# Altium project cs301_YourGroupNumber.PrjPCB
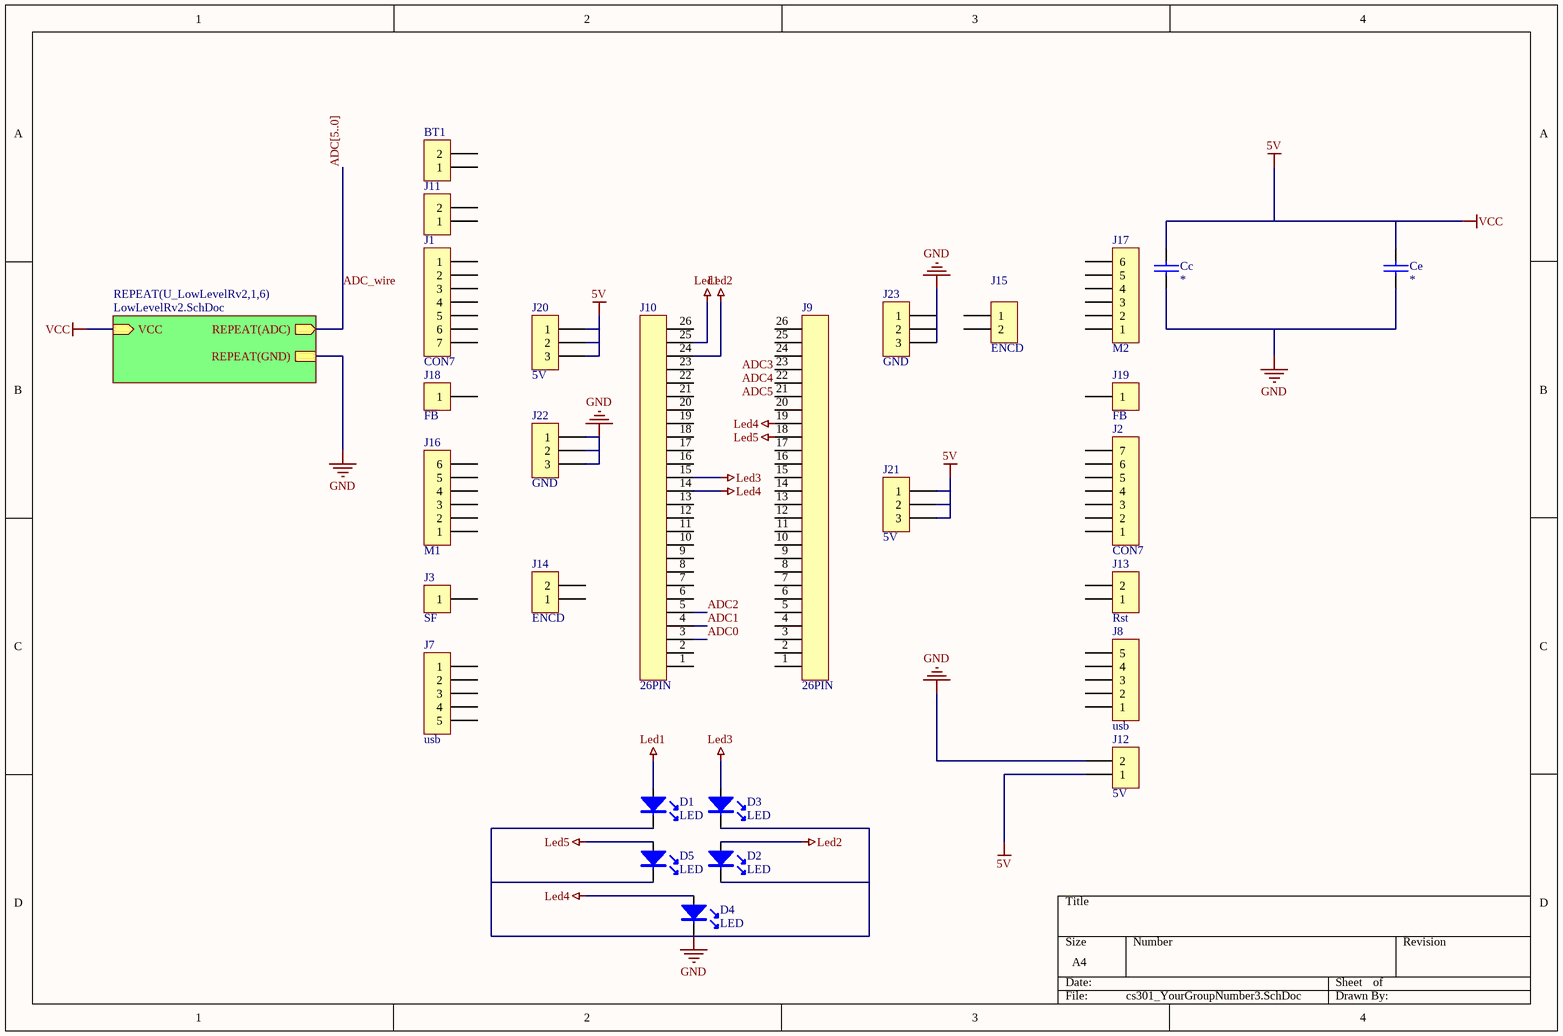
[diagram p0: cs301_YourGroupNumber3.SchDoc]
2 sheets, 118 parts. Net scope: hierarchical (ports join the sheet entries above them; power ports are global).
Board file: cs301_newrv2.PcbDoc
Sheets:
  cs301_YourGroupNumber3.SchDoc
    U_LowLevelRv21 = LowLevelRv2.SchDoc
    U_LowLevelRv22 = LowLevelRv2.SchDoc
    U_LowLevelRv23 = LowLevelRv2.SchDoc
    U_LowLevelRv24 = LowLevelRv2.SchDoc
    U_LowLevelRv25 = LowLevelRv2.SchDoc
    U_LowLevelRv26 = LowLevelRv2.SchDoc

## Sheet cs301_YourGroupNumber3.SchDoc
size A4

### Parts
BT1  Battery  [sip2]  (value not drawn)
Cc  *  [FILM CAP-0.2]
Ce  *  [FILM CAP-0.2]
D1  LED  [LED0.1/5MM]
D2  LED  [LED0.1/5MM]
D3  LED  [LED0.1/5MM]
D4  LED  [LED0.1/5MM]
D5  LED  [LED0.1/5MM]
J1  CON7  [SIP7]
J2  CON7  [SIP7]
J3  SF  [SIP1/0.6]
J7  usb  [SIP5]
J8  usb  [SIP5]
J9  26PIN  [SIP26]
J10  26PIN  [SIP26]
J11  Battery  [sip2]  (value not drawn)
J12  5V  [sip2]
J13  Rst  [sip2]
J14  ENCD  [sip2]
J15  ENCD  [sip2]
J16  M1  [sip6]
J17  M2  [sip6]
J18  FB  [SIP1/0.6]
J19  FB  [SIP1/0.6]
J20  5V  [sip3]
J21  5V  [sip3]
J22  GND  [sip3]
J23  GND  [sip3]

### Sub-sheets
REPEAT(U_LowLevelRv2,1,6) = LowLevelRv2.SchDoc: VCC (in), REPEAT(GND), REPEAT(ADC) (out)

### Nets
5V: Cc.1 Ce.1 J12.1 J20.1 J20.2 J20.3 J21.1 J21.2 J21.3 ; sheet REPEAT(U_LowLevelRv2,1,6)/VCC  [also labelled VCC]
GND: Cc.2 Ce.2 D1.K D2.K D3.K D4.K D5.K J12.2 J22.1 J22.2 J22.3 J23.1 J23.2 J23.3 ; sheet REPEAT(U_LowLevelRv2,1,6)/REPEAT(GND)
Led1: D1.A J10.25
Led2: D2.A J10.24
Led3: D3.A J10.15
Led4: D4.A J9.19 J10.14
Led5: D5.A J9.18
ADC0: J10.3
ADC1: J10.4
ADC2: J10.5
ADC3: J9.24
ADC4: J9.23
ADC5: J9.22
ADC_wire: sheet REPEAT(U_LowLevelRv2,1,6)/REPEAT(ADC)

Not connected (* = marked no-connect by the designer): BT1 1 2; J1 1 2 3 4 5 6 7; J2 1 2 3 4 5 6 7; J3 1; J7 1 2 3 4 5; J8 1 2 3 4 5; J9 1 2 3 4 5 6 7 8 9 10 11 12 13 14 15 16 17 20 21 25 26; J10 1 2 6 7 8 9 10 11 12 13 16 17 18 19 20 21 22 23 26; J11 1 2; J13 1 2; J14 1 2; J15 1 2; J16 1 2 3 4 5 6; J17 1 2 3 4 5 6; J18 1; J19 1

### Buses and harness runs
bus ADC[5..0]

### Library data of the parts
BT1 J11-J15 = CON2: Connector
Cc Ce = CAP: Capacitor Non Polarised Through Hole; Value: *
J1 J2 = CON7: Connector
J3 J18 J19 = CON1: Connector
J7 J8 = CON5: Connector
J16 J17 = CON6: Connector
J20-J23 = CON3: Connector

## Sheet LowLevelRv2.SchDoc
size A4
Used 6 times, as channels U_LowLevelRv21, U_LowLevelRv22, U_LowLevelRv23, U_LowLevelRv24, U_LowLevelRv25, U_LowLevelRv26. Parts and nets are listed once, with the designators drawn on the sheet.
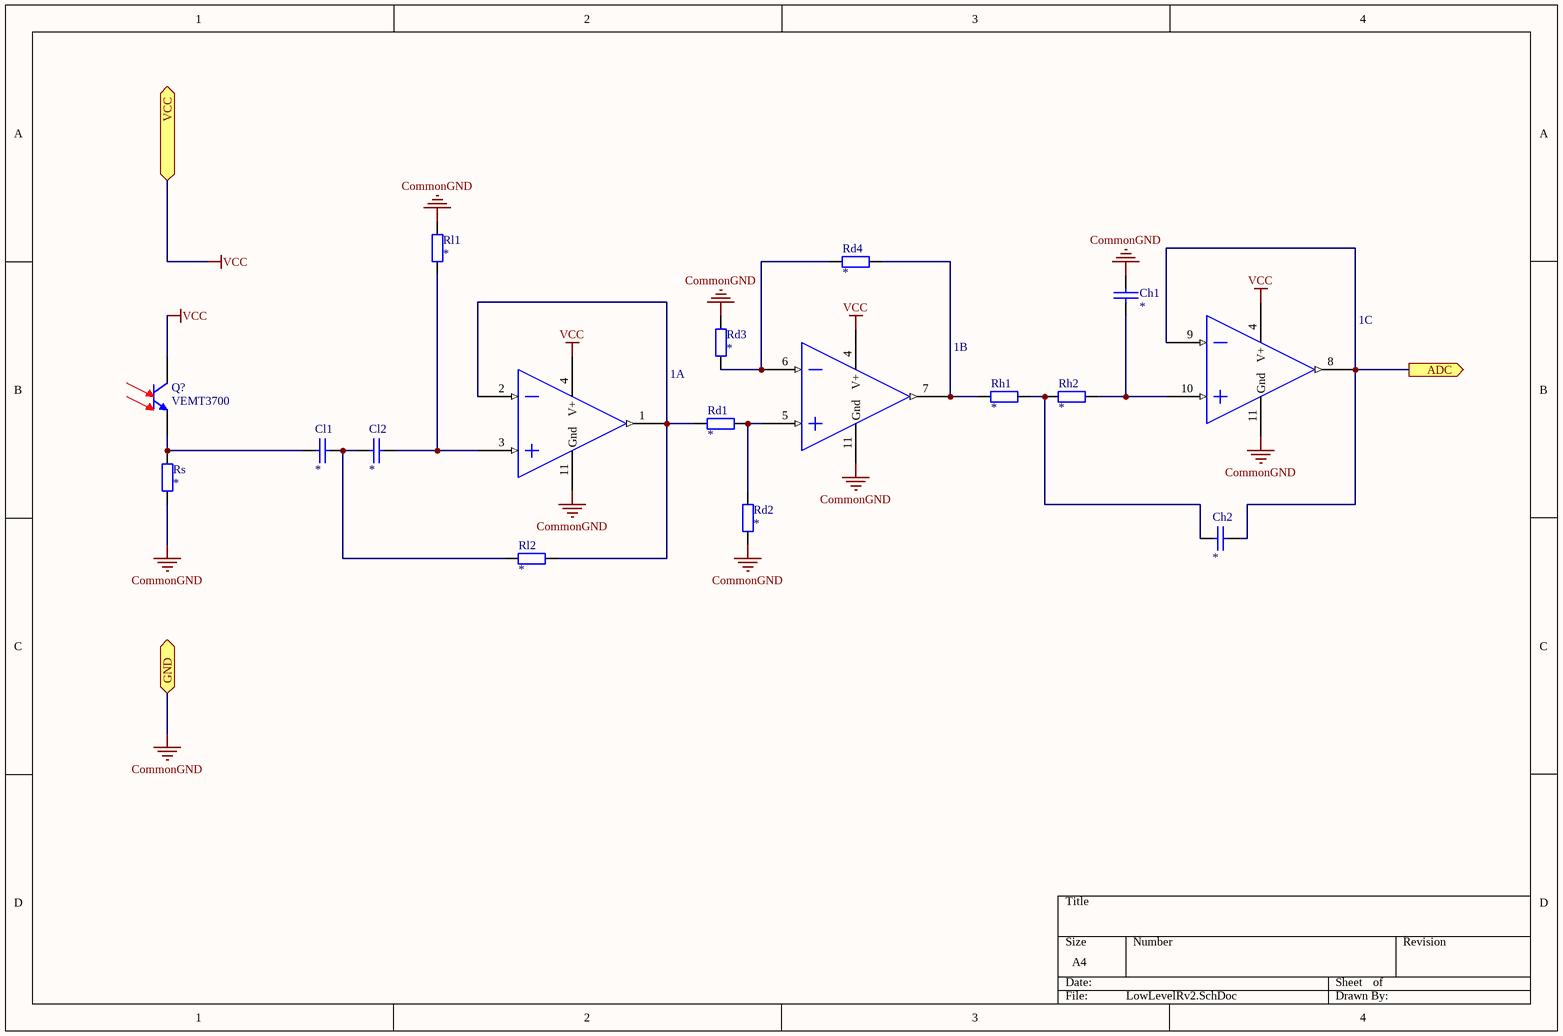
[diagram p1: LowLevelRv2.SchDoc]

### Parts
1  LM324N  [ECE-DIP14TH]  (value not drawn)  (parts A,B,C of 4)
Ch1  *  [FILM CAP-0.2]
Ch2  *  [FILM CAP-0.2]
Cl1  *  [FILM CAP-0.2]
Cl2  *  [FILM CAP-0.2]
Q?  VEMT3700  [VEMT3700]
Rd1  *  [AXIAL-0.4]
Rd2  *  [AXIAL-0.4]
Rd3  *  [AXIAL-0.4]
Rd4  *  [AXIAL-0.4]
Rh1  *  [AXIAL-0.4]
Rh2  *  [AXIAL-0.4]
Rl1  *  [AXIAL-0.4]
Rl2  *  [AXIAL-0.4]
Rs  *  [AXIAL-0.4]

### Ports
ADC (out), GND, VCC

### Nets
CommonGND: 1.11(Gnd) Ch1.1 Rd2.1 Rd3.2 Rl1.1 Rs.1 ; port GND
VCC: 1.4(V+) Q?.1(C) ; port VCC
ADC: 1.8(OUT3) 1.9(IN3(-)) Ch2.1 ; port ADC
Net1_1: 1.1(OUT1) 1.2(IN1(-)) Rd1.1 Rl2.2
Net1_3: 1.3(IN1(+)) Cl2.2 Rl1.2
Net1_5: 1.5(IN2+)) Rd1.2 Rd2.2
Net1_6: 1.6(IN2(-)) Rd3.1 Rd4.1
Net1_7: 1.7(OUT2) Rd4.2 Rh1.1
Net1_10: 1.10(IN3(+)) Ch1.2 Rh2.2
NetCh2_2: Ch2.2 Rh1.2 Rh2.1
NetCl1_1: Cl1.1 Q?.2(E) Rs.2
NetCl1_2: Cl1.2 Cl2.1 Rl2.1

### Channels
U_LowLevelRv21: designators end in _U_LowLevelRv21; ports ADC=ADC_wire1 GND=CommonGND VCC=5V
U_LowLevelRv22: designators end in _U_LowLevelRv22; ports ADC=ADC_wire2 GND=CommonGND VCC=5V
U_LowLevelRv23: designators end in _U_LowLevelRv23; ports ADC=ADC_wire3 GND=CommonGND VCC=5V
U_LowLevelRv24: designators end in _U_LowLevelRv24; ports ADC=ADC_wire4 GND=CommonGND VCC=5V
U_LowLevelRv25: designators end in _U_LowLevelRv25; ports ADC=ADC_wire5 GND=CommonGND VCC=5V
U_LowLevelRv26: designators end in _U_LowLevelRv26; ports ADC=ADC_wire6 GND=CommonGND VCC=5V

### Library data of the parts
1 = OPA000002: IC OPAMP LM324 QUAD TH; Manufactuer: Texas instruments; Assembly Method: Through hole; Item Type: Item; Path: ece/ts/Lists/Stock Inventory; UoA Stock#: OPA000002; Value: LM324N; Size/Package: DIP14; Manufacturer-PN: LM324N; Datasheet Link: http://share.engineering.auckland.ac.nz/ece/ts/Student%20Documents/LM324.pdf; Supplier1: Digikey; Supplier1-PN: 296-1391-5-ND; Supplier2: Active Components; Supplier2-PN: LM324N; Category: OpAmp; Status: Active
Ch1 Ch2 Cl1 Cl2 = CAP: Capacitor Non Polarised Through Hole; Value: *
Q? = VEMT3700: Silicon NPN Phototransistor
Rd1-Rd4 Rh1 Rh2 Rl1 Rl2 Rs = Res: Through Hole Resistor; Published: 8-Jun-2000; LatestRevisionDate: 17-Jul-2002; LatestRevisionNote: Re-released for DXP Platform.; PackageReference: AXIAL-0.4; Publisher: Altium Limited; Value: *; ComponentLink1Description: http://www.royalohm.com/pdf/product2017/PrecisionMetalMF.pdf

## Nets that join several sheets
5V: cs301_YourGroupNumber3 (9 pins), U_LowLevelRv21 (1_U_LowLevelRv21.4 Q?_U_LowLevelRv21.1), U_LowLevelRv22 (1_U_LowLevelRv22.4 Q?_U_LowLevelRv22.1), U_LowLevelRv23 (1_U_LowLevelRv23.4 Q?_U_LowLevelRv23.1), U_LowLevelRv24 (1_U_LowLevelRv24.4 Q?_U_LowLevelRv24.1), U_LowLevelRv25 (1_U_LowLevelRv25.4 Q?_U_LowLevelRv25.1), U_LowLevelRv26 (1_U_LowLevelRv26.4 Q?_U_LowLevelRv26.1)
CommonGND: U_LowLevelRv21 (6 pins), U_LowLevelRv22 (6 pins), U_LowLevelRv23 (6 pins), U_LowLevelRv24 (6 pins), U_LowLevelRv25 (6 pins), U_LowLevelRv26 (6 pins)